# EAGLE schematic 135_Antenna (EAGLE 5.11)
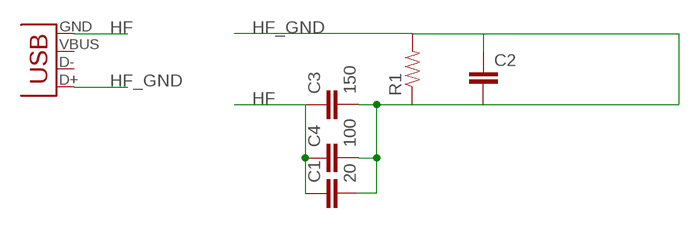
[diagram p0: schematic, sheet 1]

## Parts
C1  20  CAP0805  [0805]
C2  CAP0805  [0805]
C3  150  CAP0805  [0805]
C4  100  CAP0805  [0805]
R1  RESISTOR  [0805]
X2  USB-A-SMD  [USB-A-S-NOSILK-FEMALE]

## Nets
HF: C1.1 C3.1 C4.1 X2.GND
HF_GND: C1.2 C2.1 C2.2 C3.2 C4.2 R1.1 R1.2 X2.D+
Unconnected: X2.D- X2.VBUS

## Library data of the parts
C1-C4 = SparkFun:CAP: Capacitor Standard 0603 ceramic capacitor, and 0.1" leaded capacitor.
R1 = SparkFun:RESISTOR: Resistor Basic schematic elements and footprints for 0603, 1206, and PTH 1/10th watt (small) resistors.
X2 = CR123aBoost:USB: USB Connectors USB-B-PTH is fully proven SKU : PRT-00139 USB-miniB is fully proven SKU : PRT-00587 USB-A-PCB is untested. USB-A-H is throughly reviewed, but untested. Spark Fun Electronics SKU : PRT-00437 USB-B-SMT is throughly reviewed, but untested. Needs silkscreen touching up. USB-A-S has not been used/tested USB-MB-H has not been used/tested